# EasyEDA schematic SCH_efoil_tracker_v1.0_2026-07-30.json
TITLE: Sheet_1; REV: 1.0; Date: 2026-07-29; Sheet: 1/1; Drawn By: skulleym; Company: Your Company
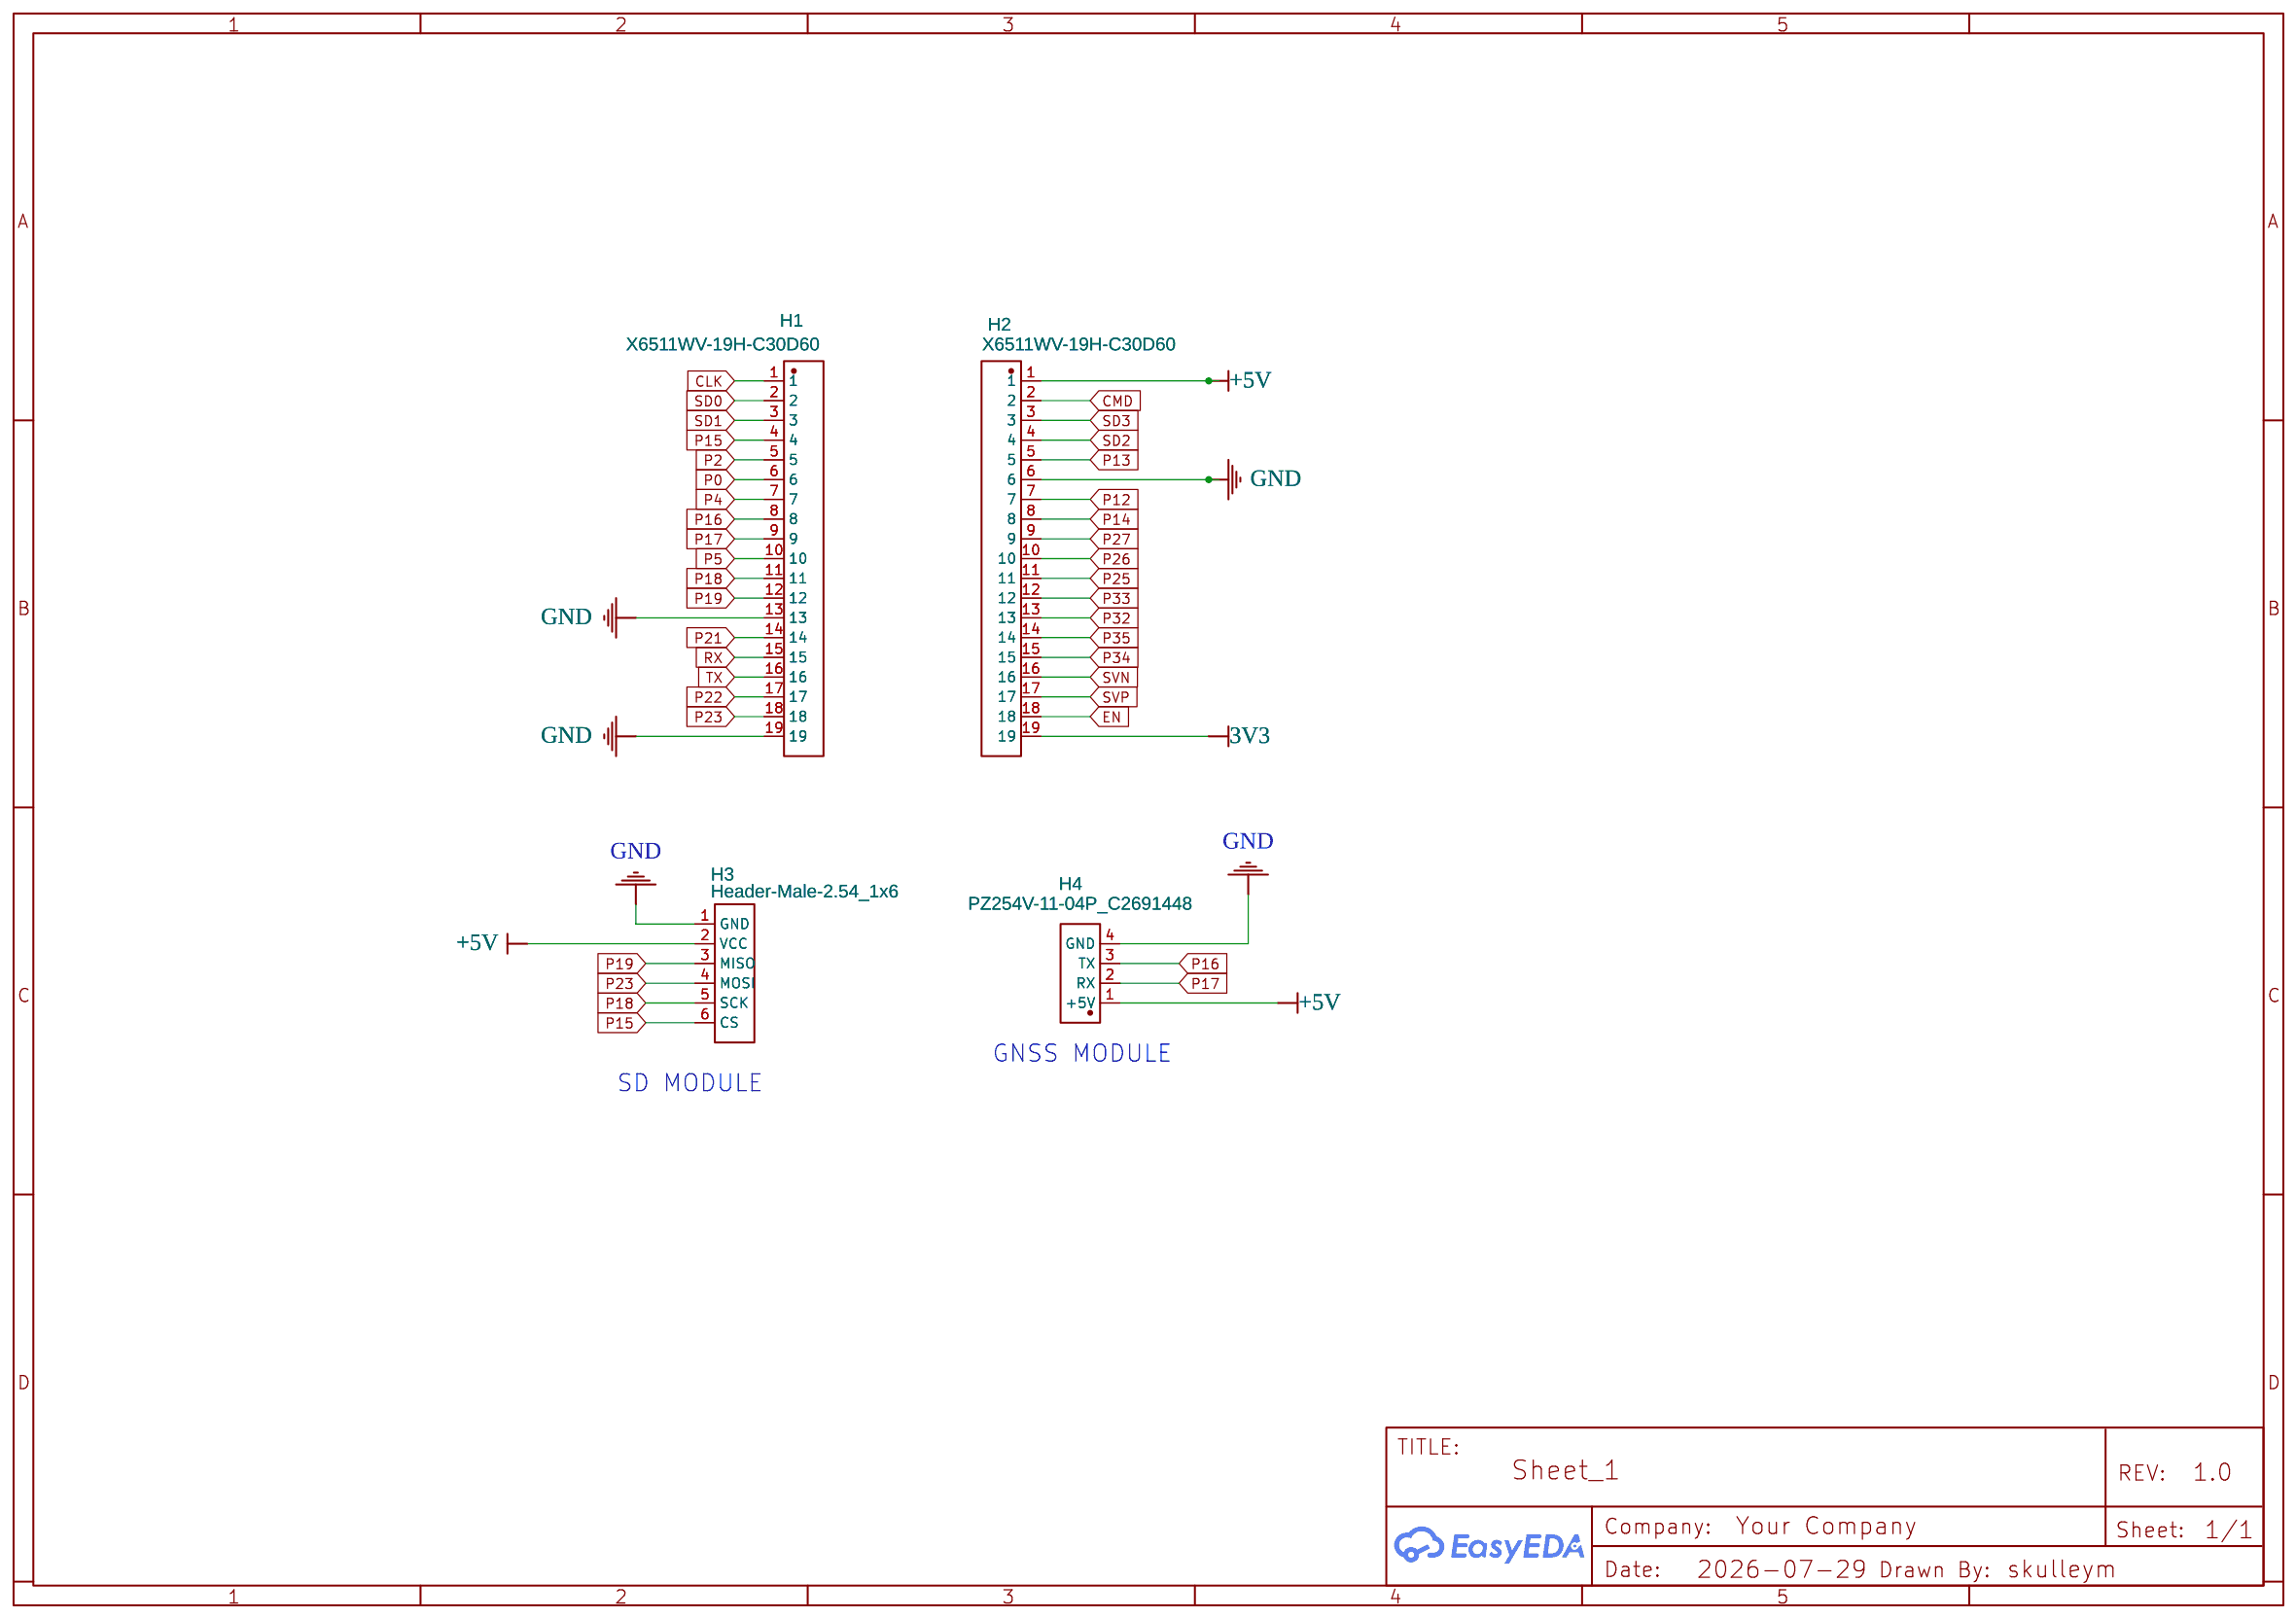
[diagram p0: schematic sheet]

## Parts
H1  X6511WV-19H-C30D60  [HDR-TH_19P-P2.54-V-M]
H2  X6511WV-19H-C30D60  [HDR-TH_19P-P2.54-V-M]
H3  Header-Male-2.54_1x6  [HDR-TH_6P-P2.54-V-M-1]
H4  PZ254V-11-04P_C2691448  [HDR-TH_4P-P2.54-V-M]

## Library data of the parts
H1 H2 = X6511WV-19H-C30D60: Contributor: LCSC; Supplier: LCSC; Supplier Part: C725951; Manufacturer: XKB Connection(中国星坤); Manufacturer Part: X6511WV-19H-C60D30; JLCPCB Part Class: Extended Part
H3 = Header-Male-2.54_1x6: Supplier: LCSC; Manufacturer: BOOMELE(博穆精密); Manufacturer Part: 2.54-1x6P直针; Supplier Part: C37208; JLCPCB Part Class: Extended Part
H4 = PZ254V-11-04P_C2691448: Contributor: LCSC; Supplier: LCSC; Supplier Part: C2691448; Manufacturer: XFCN(兴飞); Manufacturer Part: PZ254V-11-04P; JLCPCB Part Class: Extended Part

## Nets
3V3: H2.19
+5V: H2.1 H3.2(VCC) H4.1(+5V)
GND: H1.13 H1.19 H2.6 H3.1(GND) H4.4(GND)
CLK: H1.1
CMD: H2.2
EN: H2.18
P0: H1.6
P2: H1.5
P4: H1.7
P5: H1.10
P12: H2.7
P13: H2.5
P14: H2.8
P15: H1.4 H3.6(CS)
P16: H1.8 H4.3(TX)
P17: H1.9 H4.2(RX)
P18: H1.11 H3.5(SCK)
P19: H1.12 H3.3(MISO)
P21: H1.14
P22: H1.17
P23: H1.18 H3.4(MOSI)
P25: H2.11
P26: H2.10
P27: H2.9
P32: H2.13
P33: H2.12
P34: H2.15
P35: H2.14
RX: H1.15
SD0: H1.2
SD1: H1.3
SD2: H2.4
SD3: H2.3
SVN: H2.16
SVP: H2.17
TX: H1.16

## Notes on the sheet
- GNSS MODULE
- SD MODULE
